# EAGLE design imu_board (EAGLE 6.6.0)
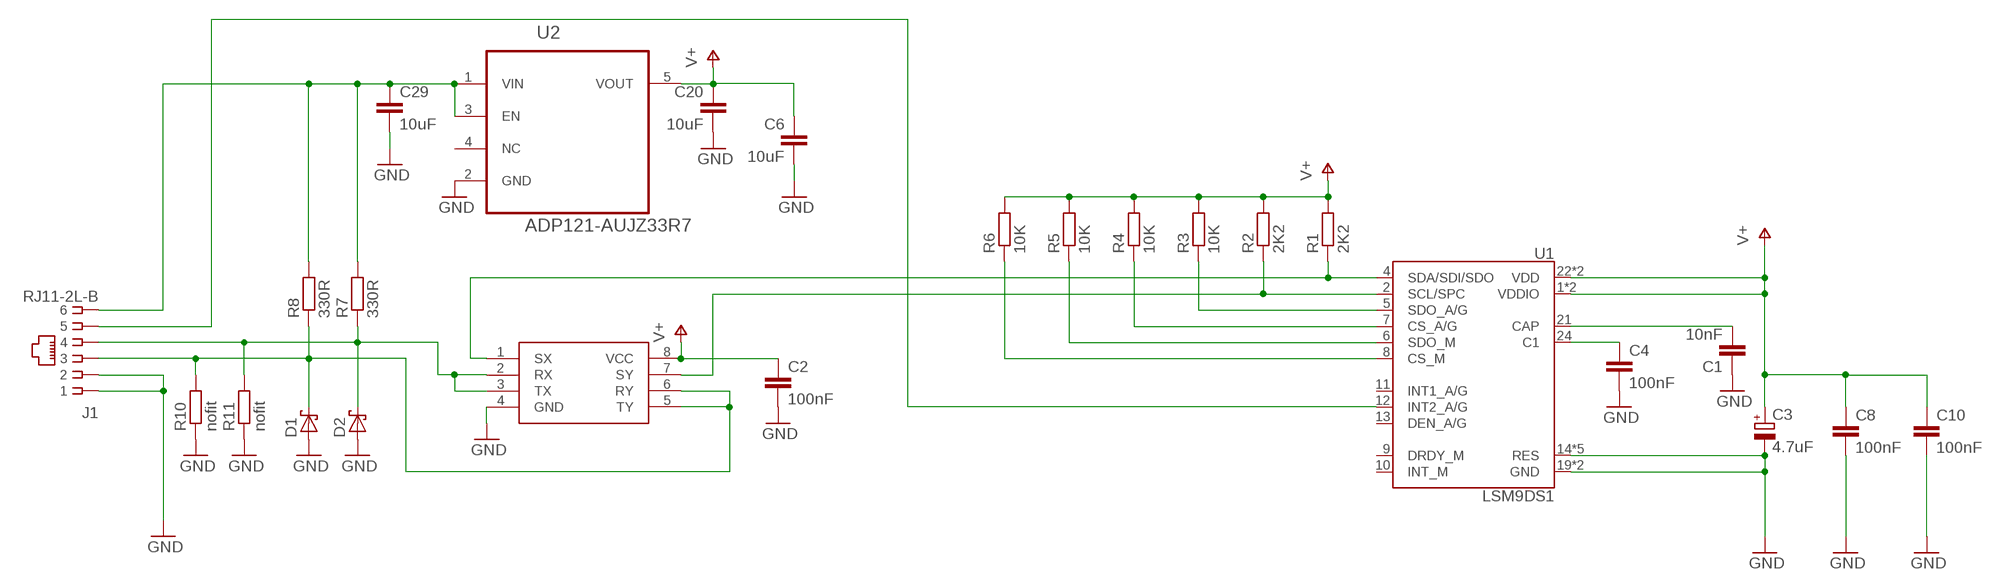
[diagram p0: schematic, sheet 1]

## Parts
C1  10nF  C-EUC0805  [C0805]
C2  100nF  C-EUC0805  [C0805]
C3  4.7uF  CPOL-EUSMCC  [SMC_C]
C4  100nF  C-EUC0805  [C0805]
C6  10uF  C-EUC1206  [C1206]
C8  100nF  C-EUC0805  [C0805]
C10  100nF  C-EUC0805  [C0805]
C20  10uF  C-EUC1206  [C1206]
C29  10uF  C-EUC1206  [C1206]
D1  SCHOTTKY-DIODE  [DIODE_SMB]
D2  SCHOTTKY-DIODE  [DIODE_SMB]
J1  RJ11-2L-B  [RJ11-NO_SHIELD]
R1  2K2  R-EU_R0805  [R0805]
R2  2K2  R-EU_R0805  [R0805]
R3  10K  R-EU_R0805  [R0805]
R4  10K  R-EU_R0805  [R0805]
R5  10K  R-EU_R0805  [R0805]
R6  10K  R-EU_R0805  [R0805]
R7  330R  R-EU_R0805  [R0805]
R8  330R  R-EU_R0805  [R0805]
R10  nofit  R-EU_R1206  [R1206]
R11  nofit  R-EU_R1206  [R1206]
U1  LSM9DS1  [LGA24-8X4]
U2  ADP121-AUJZ33R7  [SOT95P280X100-5N]
U$1  P82B96  [DIP8]

## Nets
GND: C1.1 C2.2 C3.- C4.2 C6.2 C8.2 C10.2 C20.2 C29.2 D1.A(C) D2.A(C) J1.1 J1.2 R10.1 R11.1 U1.14(RES) U1.15(RES) U1.16(RES) U1.17(RES) U1.18(RES) U1.19(GND) U1.20(GND) U2.2(GND) U$1.4(GND)
N$1: C1.2 U1.21(CAP)
N$2: C4.1 U1.24(C1)
N$3: J1.5 U1.12(INT2_A/G)
N$5: R3.1 U1.5(SDO_A/G)
N$6: R4.1 U1.7(CS_A/G)
N$7: R5.1 U1.6(SDO_M)
N$8: R6.1 U1.8(CS_M)
N$9: D2.C(A) J1.4 R7.1 R11.2 U$1.2(RX) U$1.3(TX)
N$10: D1.C(A) J1.3 R8.1 R10.2 U$1.5(TY) U$1.6(RY)
N$46: C29.1 J1.6 R7.2 R8.2 U2.1(VIN) U2.3(EN)
SCL: R2.1 U1.2(SCL/SPC) U$1.7(SY)
SDA: R1.1 U1.4(SDA/SDI/SDO) U$1.1(SX)
V+: C2.1 C3.+ C6.1 C8.1 C10.1 C20.1 R1.2 R2.2 R3.2 R4.2 R5.2 R6.2 U1.1(VDDIO) U1.3(VDDIO) U1.22(VDD) U1.23(VDD) U2.5(VOUT) U$1.8(VCC)
Unconnected: U1.9(DRDY_M) U1.10(INT_M) U1.11(INT1_A/G) U1.13(DEN_A/G) U2.4(NC)

## Library data of the parts
C1 C2 C4 C6 C8 C10 C20 C29 = rcl:C-EU: CAPACITOR, European symbol
C3 = rcl:CPOL-EU: POLARIZED CAPACITOR, European symbol
D1 D2 = eagle-ltspice:SCHOTTKY-DIODE: Schottky Diode; SPICEMODEL: NONE; SPICEPREFIX: D; SPICETYPE: diode
J1 = con-tycoelectronics:RJ11: CORCOM Modular RJ Jacks No Shield Source: www.tycoelectronics.com .. ENG_DS_1654001_1099_RJ_L_0507.pdf; MF: TYCO ELECTRONICS; MPN: RJ11-2L-B; OC_FARNELL: unknown; OC_NEWARK: 83F4463
R1-R8 R10 R11 = rcl:R-EU_: RESISTOR, European symbol
U1 = LSM9DS1_temp:LSM9DS1: LSM9DS1 3D accelerometer, gyroscope & magnetometer The LSM9DS1 is a system-in-package featuring a 3D digital linear acceleration sensor, a 3D digital angular rate sensor, and a 3D digital magnetic sensor. The LSM9DS1 has a linear acceleration full scale of ±2g/±4g/±8/±16 g, a magnetic field full scale of ±4/±8/±12/±16 gauss and an angular rate of ±245/±500/±2000 dps. The LSM9DS1 includes an I2 C serial bus interface supporting standard and fast mode (100 kHz and 400 kHz) and an SPI serial standard interface. Magnetic, accelerometer and gyroscope sensing can be enabled or set in power-down mode separately for smart power management. The LSM9DS1 is available in a plastic land grid array package (LGA) and it is guaranteed to operate over an extended temperature range from -40 °C to +85 °C.; PROD_ID: IC-12536
U2 = adp121:ADP121-AUJZ33R7: 150 mA, Low Quiescent Current, CMOS Linear Regulator; MPN: ADP121-AUJZ33R7; OC_FARNELL: 2074869; OC_NEWARK: 10R7024; PACKAGE: TSOT-5; SUPPLIER: Analog Devices
U$1 = p82b96:P82B96

## Board
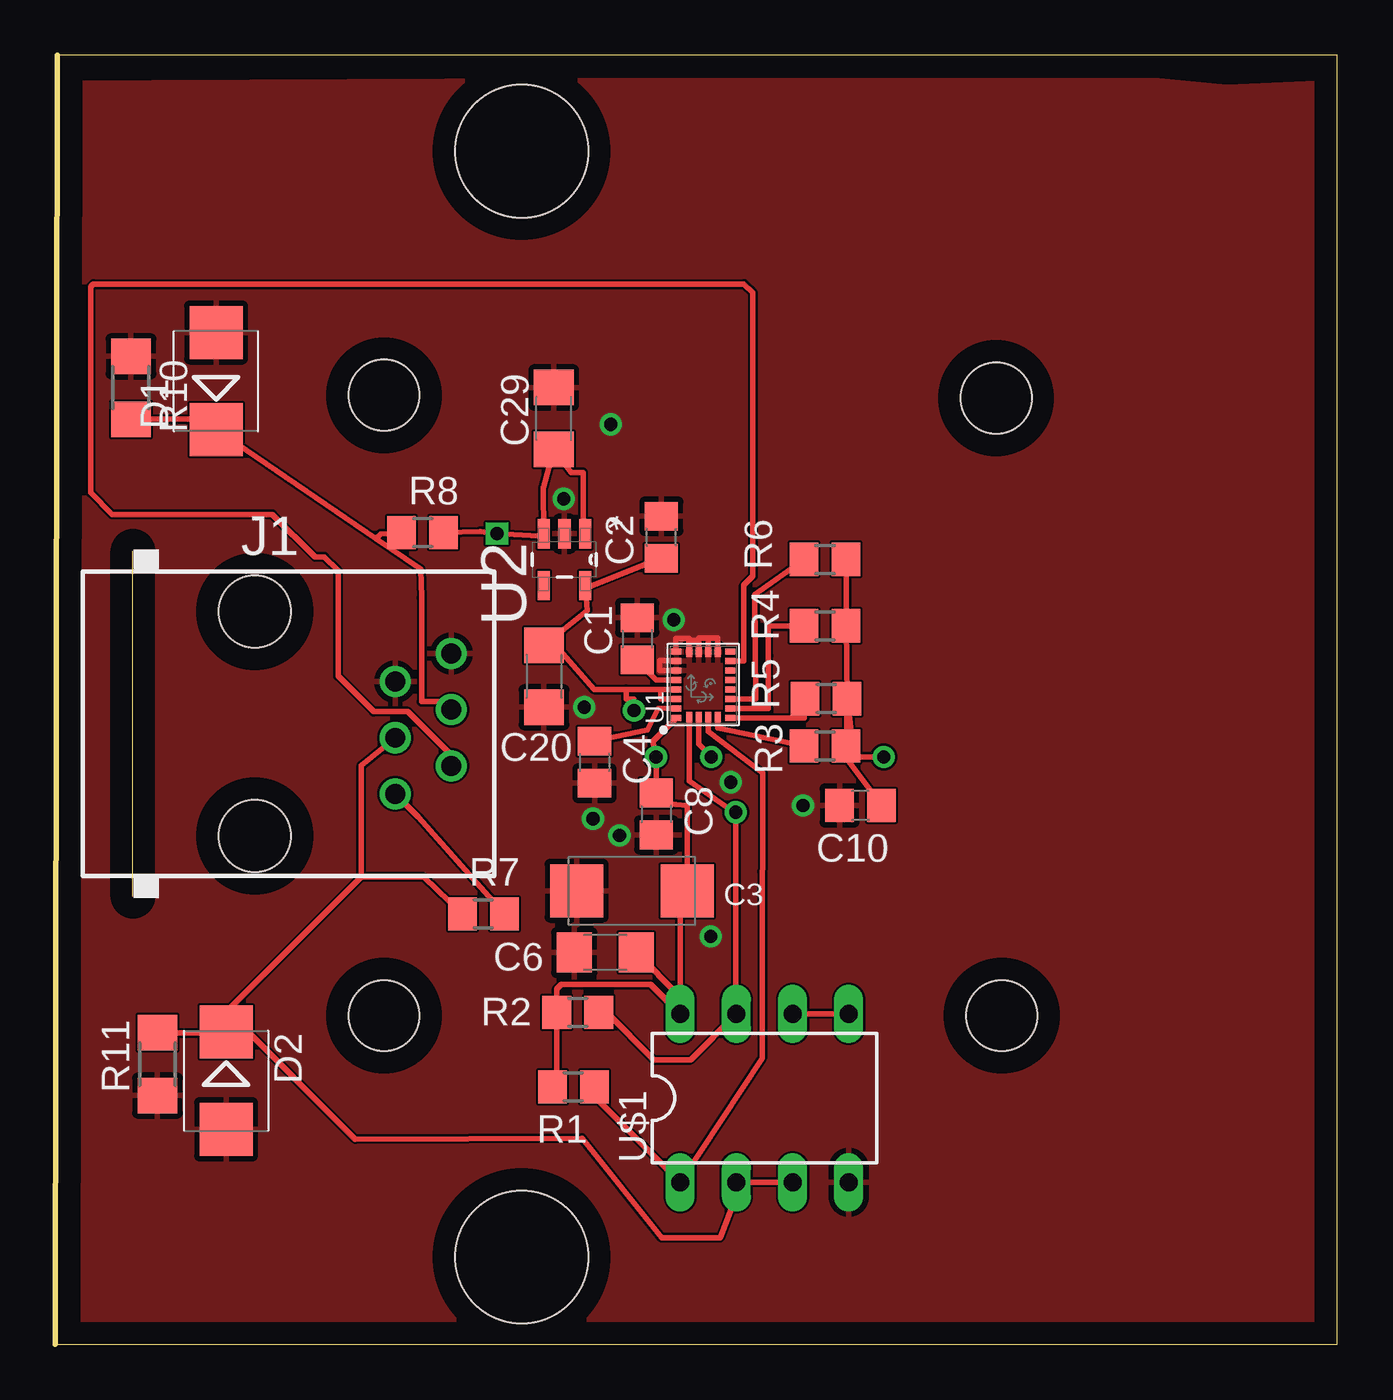
[diagram p1: board, top side]
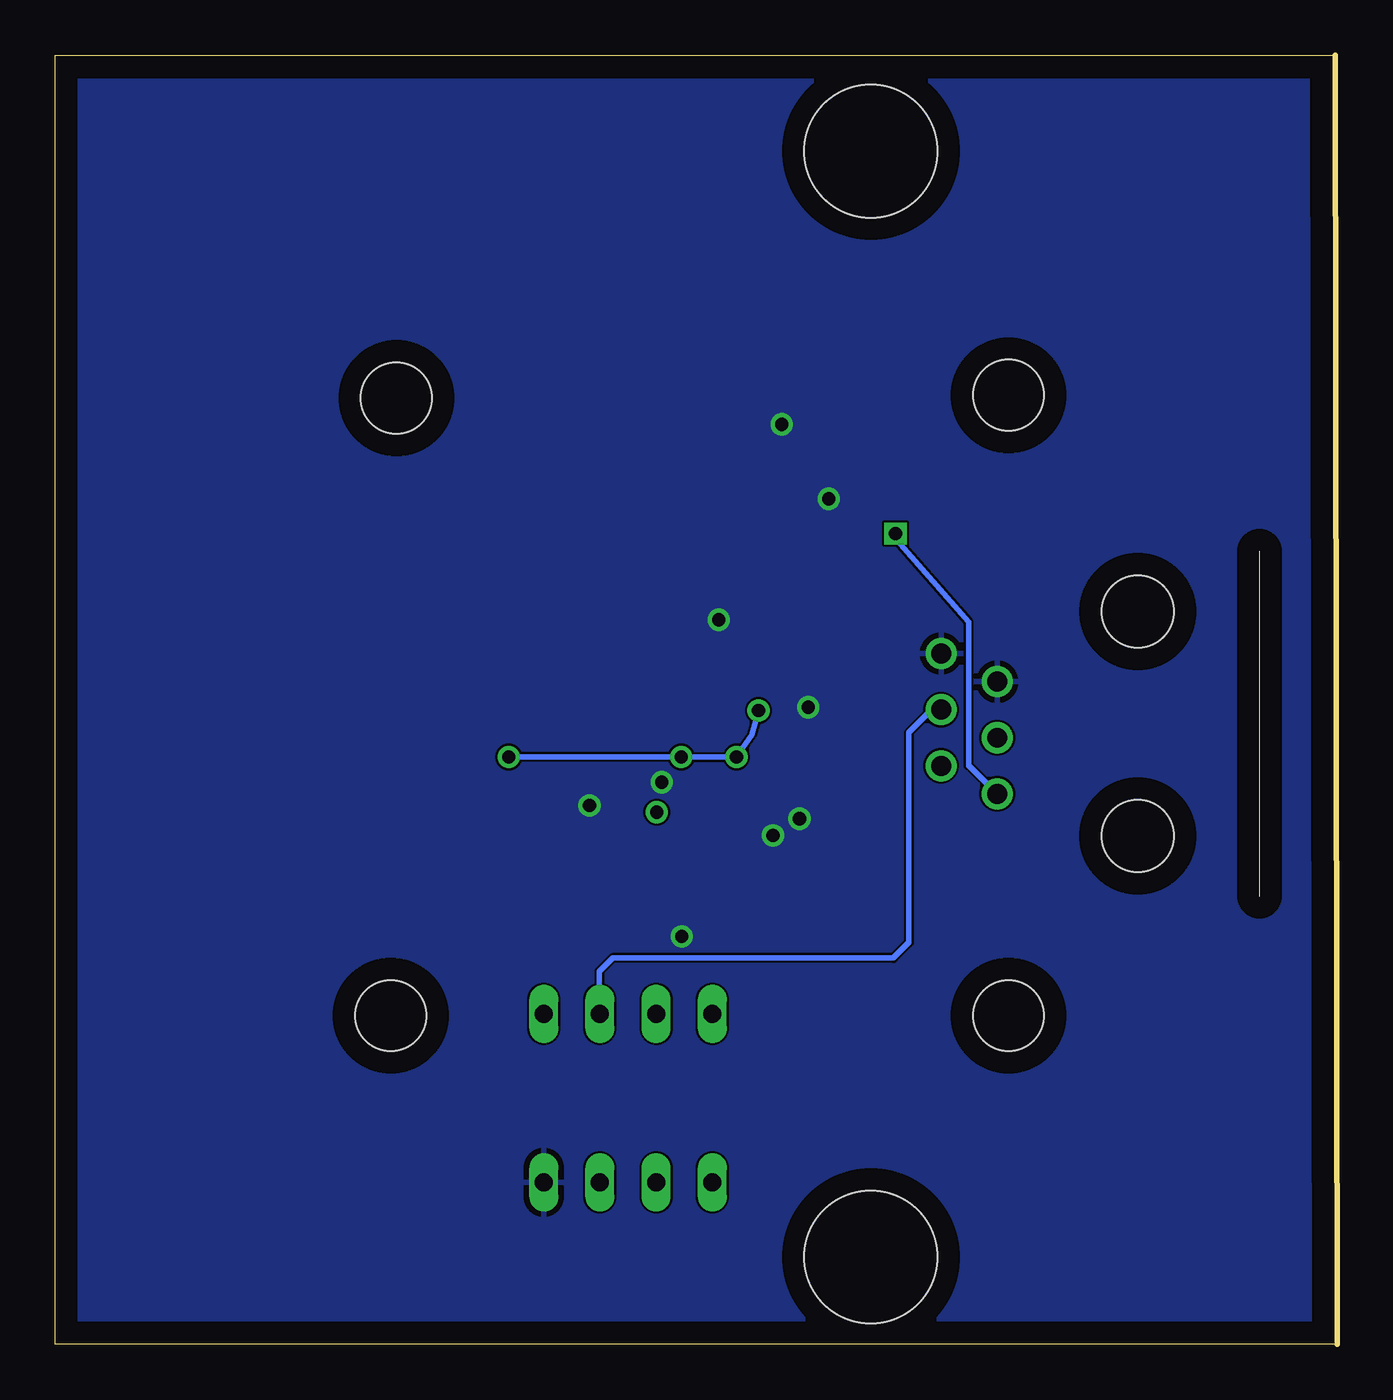
[diagram p2: board, bottom side, seen from below]

Size 57.98 x 58.32 mm. Coordinates in mm from the lower left corner, seen from the top.
Outline: 0,0 57.98,0 57.98,58.32 0.1,58.32 0,0
Copper layers (1*16): Top 0.035mm / dielectric 1.5mm / Bottom 0.035mm
Design rules "default *": minimum track width 10mil, minimum drill 24mil, track to track 4mil, track to pad 4mil, pad to pad 4mil, via to via 8mil, smd to smd 4mil, copper to edge 40mil, drill to drill 8mil, minimum pad ring 10mil, minimum via ring 8mil, stop-mask expansion 4mil, vias tented up to drill 0mil, thermal gap 10mil
Holes 3.2 mm at 14.87,14.87 14.87,42.93 42.81,14.87 42.55,42.81
Holes 6 mm at 21.09,3.95 21.09,53.98

### Footprints (pad centres in the part's own frame; a part is rotated, then mirrored left to right if it is on the bottom)
C0805 = smd 1.3 x 1.5: 1 -0.95,0; 2 0.95,0
SMC_C = smd 2.4 x 2.4: + -2.5,0; - 2.5,0
C1206 = smd 1.6 x 1.8: 1 -1.4,0; 2 1.4,0
DIODE_SMB = smd 2.4 x 2.4: A 2.2,0; C -2.2,0
RJ11-NO_SHIELD = drill 0.9 pad 1.4: 1 -3.175,8.89; 2 -1.905,6.35; 3 -0.635,8.89; 4 0.635,6.35; 5 1.905,8.89; 6 3.175,6.35 | hole 3.251: -5.08,0; 5.08,0
R0805 = smd 1.3 x 1.5: 1 -0.95,0; 2 0.95,0
R1206 = smd 1.6 x 1.803: 1 -1.422,0; 2 1.422,0
LGA24-8X4 = smd 0.27 x 0.45: 1 -1.505,1.225; 6 -1.505,-1.225; 7 -1.075,-1.225; 8 -0.645,-1.225; 9 -0.215,-1.225; 10 0.215,-1.225; 11 0.645,-1.225; 12 1.075,-1.225; 13 1.505,-1.225; 18 1.505,1.225; 19 1.075,1.225; 20 0.645,1.225; 21 0.215,1.225; 22 -0.215,1.225; 23 -0.645,1.225; 24 -1.075,1.225 | smd 0.45 x 0.27: 2 -1.475,0.645; 3 -1.475,0.215; 4 -1.475,-0.215; 5 -1.475,-0.645; 14 1.475,-0.645; 15 1.475,-0.215; 16 1.475,0.215; 17 1.475,0.645
SOT95P280X100-5N = smd 1.321 x 0.559: 1 -1.168,0.94; 2 -1.168,0; 3 -1.168,-0.94; 4 1.168,-0.94; 5 1.168,0.94
DIP8 = drill 0.813 long: 1 -2.54,-3.81; 2 0,-3.81; 3 2.54,-3.81; 4 5.08,-3.81; 5 5.08,3.81; 6 2.54,3.81; 7 0,3.81; 8 -2.54,3.81

### Placement (x,y rotation side)
C1  26.32,31.92 270 top
C2  27.41,36.51 90 top
C3  26.08,20.52 180 top
C4  24.39,26.33 270 top
C6  24.87,17.72 180 top
C8  27.18,23.99 270 top
C10  36.42,24.37 180 top
C20  22.1,30.22 270 top
C29  22.55,41.89 90 top
D1  7.27,43.57 90 top
D2  7.72,11.92 270 top
J1  9.02,28.08 270 top
R1  23.43,11.65 180 top
R2  23.63,15.01 180 top
R3  34.81,27.07 0 top
R4  34.81,32.5 0 top
R5  34.86,29.21 0 top
R6  34.81,35.51 0 top
R7  19.36,19.48 0 top
R8  16.61,36.73 0 top
R10  3.42,43.27 270 top
R11  4.62,12.67 90 top
U1  29.31,29.85 90 top
U2  23.03,35.5 270 top
U$1  30.8,11.14 0 top

### Tracks (layer width: path | path; a pad name or v marks a point on that pad's centre or on a via)
GND  (via drill 0.6)
  Top 0.254: 28.63,31.35 U1.17 | U1.20 27.35,30.49 27.35,30.92 U1.19 | U1.18 28.07,31.92 28.66,31.92 U1.17 | U1.17 28.65,31.32 28.65,31.85 29.09,31.85 U1.16 29.1,31.95 29.52,31.95 | 29.52,31.95 | 29.52,31.95 U1.15 29.52,31.95 | 29.52,31.95 29.95,31.95 U1.14
  other vias: 33.82,24.37 25.52,23.02 24.32,23.77 27.97,32.77 25.12,41.62 23.92,28.82 23,38.25 29.65,18.45 30.55,25.42
  pour Top: -0.18,0.67 48.65,0.65 57.77,0.65 57.77,37.27 57.56,57.09 52.99,56.87 48.53,57.31 -0.05,57.06
  pour Bottom: 0.39,57.41 0.52,0.52 57.77,0.04 57.26,57.44
N$1
  Top 0.254: C1.2 26.32,30.93 27.17,30.05 28.07,30.05 U1.21
N$2
  Top 0.254: C4.1 26.77,27.78 27.27,28.77 28.07,28.78 U1.24
N$3
  Top 0.254: J1.5 17.92,26.66 15.95,28.62 14.4,28.62 12.8,30.22 12.8,35 12.17,35.62 11.75,35.62 9.82,37.55 2.57,37.55 1.6,38.52 1.6,47.85 1.72,47.97 31.15,47.97 31.55,47.57 31.55,34.75 31.15,34.35 31.15,30.92 U1.12
N$5
  Top 0.254: R3.1 29.95,27.88 U1.5
N$6
  Top 0.254: U1.7 32.25,28.77 32.25,31.15 32.25,32.5 R4.1
N$7
  Top 0.254: U1.6 31.21,28.34 33.02,28.32 33.88,28.32 R5.1
N$8
  Top 0.254: 30.55,29.21 U1.8 30.56,29.2 31.67,29.2 31.64,33.91 R6.1
N$9
  Top 0.254: D2.C 7.77,15.07 | 7.77,15.07 13.85,21.15 | 13.85,21.15 13.85,26.19 J1.4 | U$1.3 U$1.2 30.71,6.46 30.07,4.82 27.42,4.82 23.82,9.32 13.57,9.27 8,14.85 | 8,14.85 7.77,15.07 | R7.1 16.66,21.13 13.85,21.15 | R11.2 8,14.09 8,14.85
N$10
  Top 0.254: 14.5,36.45 D1.C 7.27,41.85 R10.2 | 14.5,36.45 16.52,35.07 16.57,33.77 16.57,29.07 17.55,29.07 J1.3 | 33.42,15.02 U$1.6 U$1.5 | R8.1 14.71,36.66 14.5,36.45
  Bottom 0.254: J1.3 18.34,28.71 19.37,27.67 19.37,18.17 20.07,17.47 32.77,17.47 33.37,16.87 33.37,14.97 U$1.6
N$46  (via drill 0.6)
  Top 0.254: 24.07,36.67 U2.1 23.87,36.67 23.87,39.45 23.35,39.45 C29.1 22.09,38.81 22.06,38.76 U2.3 21.89,36.57 v19.97,36.67 19.22,36.78 R8.2 | R7.2 16.41,23.86 J1.6
  Bottom 0.254: v19.97,36.67 20.07,36.57 16.67,32.67 16.67,26.17 16.64,26.17 J1.6
SCL  (via drill 0.6)
  Top 0.254: U1.2 28.66,25.48 30.62,24.12 v30.77,24.07 30.77,14.98 | 30.77,14.98 U$1.7 28.73,12.87 27.07,12.87 24.93,15.01 R2.1 | 30.77,14.98 30.77,14.07
SDA
  Top 0.254: U1.4 29.52,27.72 32,25.85 32,21.55 31.97,21.37 31.97,12.93 U$1.1 24.38,11.21 R1.1
V+  (via drill 0.6)
  Top 0.254: 25.82,29.62 24.37,29.62 22.62,31.63 C20.1 24.07,33.2 U2.5 24.07,34.23 C2.1 | 25.82,29.62 27.38,29.62 | 27.38,29.62 U1.22 | R6.2 R4.2 R5.2 | R5.2 R3.2 | 27.38,29.62 27.38,29.18 U1.23 | U1.1 27.02,27.27 v27.17,26.57 27.17,24.6 C8.1 27.3,24.47 28.07,24.42 28.58,24.38 C3.+ 28.27,20.05 U$1.8 | U1.3 29.09,27.15 v29.67,26.57 | R5.2 36.13,26.57 v37.47,26.57 35.72,26.57 35.77,26.52 C10.1 | 28.25,14.93 U$1.8 | R1.2 22.68,11.85 R2.2 22.68,16.08 22.87,16.27 26.94,16.27 | 26.94,16.27 U$1.8 | 26.94,16.27 26.94,16.26 28.27,14.92 | 28.32,14.87 28.27,14.92 | 28.27,14.92 28.27,15.72 C6.1 | v26.17,28.67 26.17,29.2 25.82,29.2 25.82,29.62
  Bottom 0.254: v26.17,28.67 26.47,27.57 v27.17,26.57 v29.67,26.57 v37.47,26.57 37.57,26.47